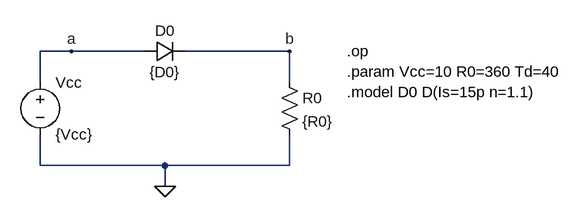
[diagram p0: schematic LAB EaD 01 B.asc]
LAB EaD 01 B.asc, the LTspice schematic file:
Version 4
SHEET 1 880 680
WIRE 48 64 0 64
WIRE 160 64 48 64
WIRE 384 64 224 64
WIRE 0 112 0 64
WIRE 384 112 384 64
WIRE 0 240 0 192
WIRE 192 240 0 240
WIRE 384 240 384 192
WIRE 384 240 192 240
WIRE 192 272 192 240
FLAG 192 272 0
FLAG 48 64 a
FLAG 384 64 b
SYMBOL voltage 0 96 R0
SYMATTR InstName Vcc
SYMATTR Value {Vcc}
SYMBOL diode 160 80 R270
WINDOW 0 32 32 VTop 2
WINDOW 3 0 32 VBottom 2
SYMATTR InstName D0
SYMATTR Value {D0}
SYMBOL res 368 96 R0
SYMATTR InstName R0
SYMATTR Value {R0}
TEXT 472 64 Left 2 !.op\n.param Vcc=10 R0=360 Td=40\n.model D0 D(Is=15p n=1.1)

The netlist it stands for:
* LAB EaD 01 B.asc
Vcc a 0 {Vcc}
D0 a b {D0}
R0 b 0 {R0}
.model D D
.lib standard.dio
.op
.param Vcc=10 R0=360 Td=40
.model D0 D(Is=15p n=1.1)
.backanno
.end

* Results of the author's LTspice run, read from the files saved beside the schematic
* Operating Point:
*   V(a) = 10 V
*   V(b) = 9.395 V
*   I(D0) = 26.1 mA
*   I(R0) = 26.1 mA
*   I(Vcc) = -26.1 mA
* From the log:
*   Semiconductor Device Operating Points:
*                           --- Diodes ---
*   Name:      d0
*   Model:     d0
*   Id:      2.61e-02
*   Vd:      6.05e-01
*   Req:     1.09e+00
*   CAP:     0.00e+00